# EAGLE design mapleCUL_small-V2.0_019 (EAGLE 9.1.1)
MAPLE-CUx Large Version
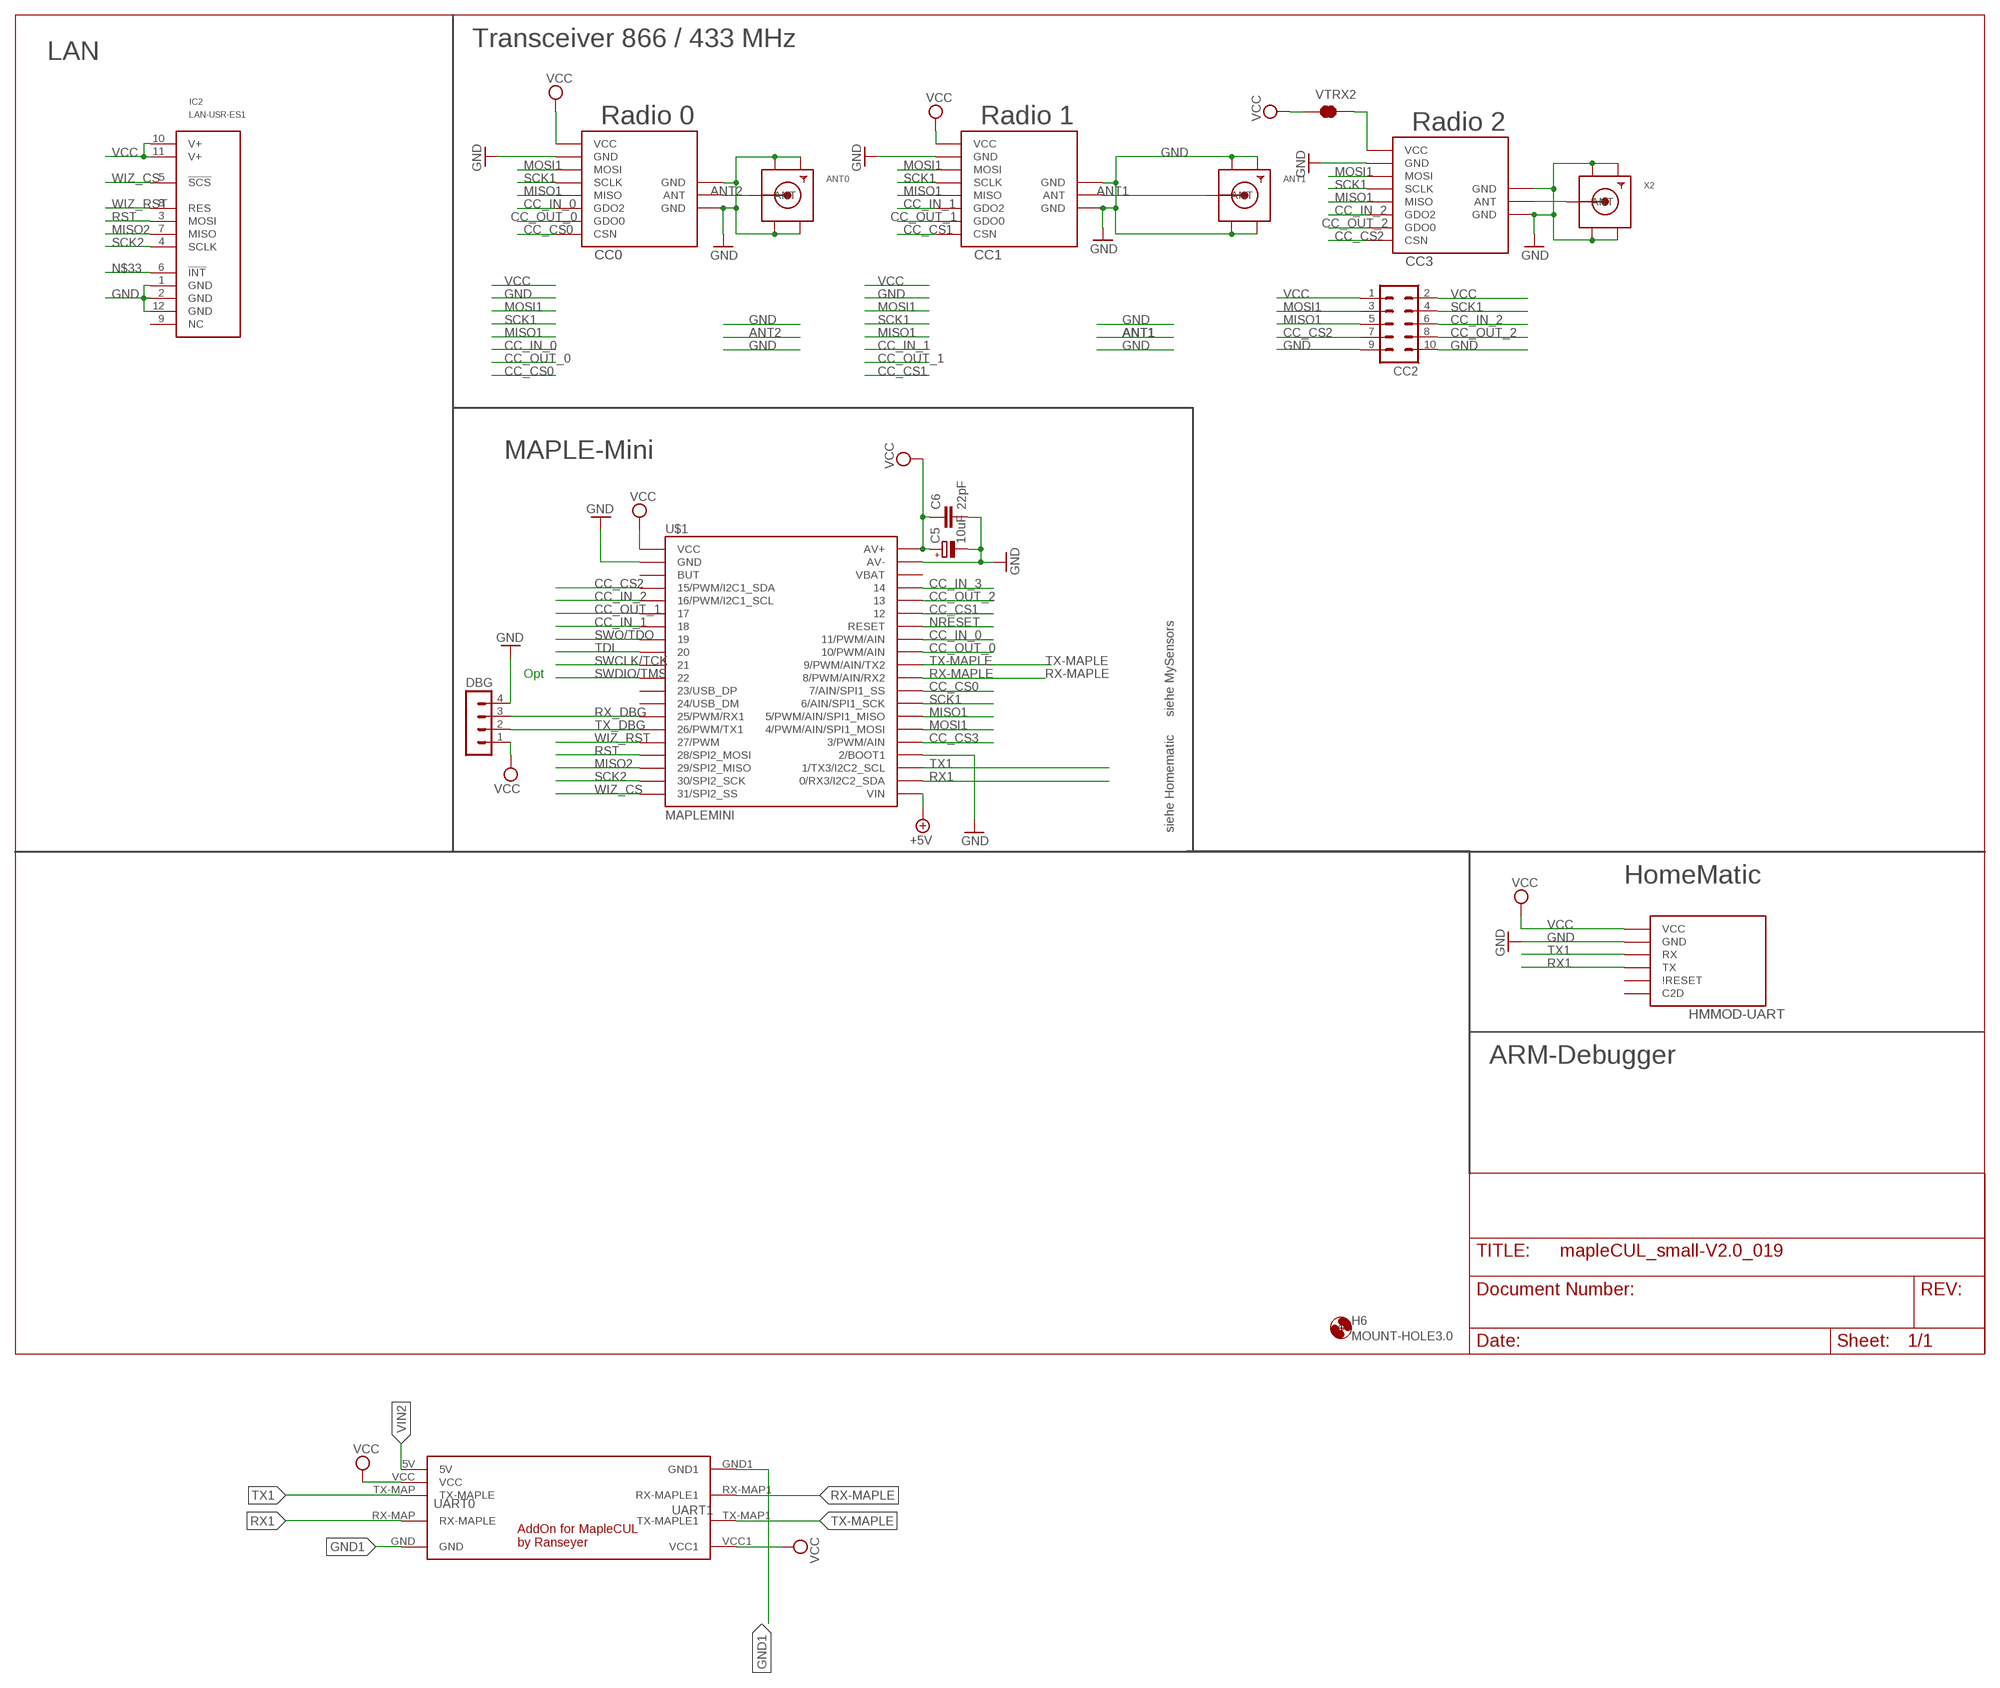
[diagram p0: schematic, sheet 1]

## Parts
ANT0  SMACONNECTOR_EDGE_UFL  [SMA_EDGELAUNCH_UFL]
ANT1  SMACONNECTOR_EDGE_UFL  [SMA_EDGELAUNCH_UFL]
C5  10uF  CPOL-EUR/2012-12W  [R/2012-12W]
C6  22pF  C-EUC0805  [C0805]
CC0  CC1101  CC1101_MODULE1SMD  [CC1101_MODULE1_SMD]
CC1  CC1101_MODULE1SMD  [CC1101_MODULE1_SMD]
CC2  MA05-2  [MA05-2]
CC3  CC1101_MODULE1SMD  [CC1101_MODULE1_SMD]
DBG  MA04-1  [MA04-1]
H6  MOUNT-HOLE3.0  [3,0]
HMMOD-UART  HM-MOD-UARTDIL  [HM-MOD-UART-DIL]
IC2  LAN-USR-ES1  [USR-ES1]
U$1  MAPLEMINI  [20-DIP]
U$3  MAPLE-CUL-ADDON-V01  [MAPLE-CUL-V01]
VTRX2  JUMPER-SMT_2_NC_TRACE_SILK  [SMT-JUMPER_2_NC_TRACE_SILK]
X2  SMACONNECTOR_EDGE  [SMA_EDGELAUNCH]

## Nets
+5V [PWR]: U$1.21(VIN)
ANT1 [PWR]: ANT1.P(ANT) CC1.ANT
ANT2: ANT0.P(ANT) CC0.ANT
ANT3: CC3.ANT X2.P(ANT)
CC_CS0: CC0.CSN U$1.29(7/AIN/SPI1_SS)
CC_CS1: CC1.CSN U$1.35
CC_CS2: CC2.7 CC3.CSN U$1.4(15/PWM/I2C1_SDA)
CC_CS3: U$1.25(3/PWM/AIN)
CC_IN_0: CC0.GDO2 U$1.33(11/PWM/AIN)
CC_IN_1: CC1.GDO2 U$1.7
CC_IN_2: CC2.6 CC3.GDO2 U$1.5(16/PWM/I2C1_SCL)
CC_IN_3: U$1.37
CC_OUT_0: CC0.GDO0 U$1.32(10/PWM/AIN)
CC_OUT_1: CC1.GDO0 U$1.6
CC_OUT_2: CC2.8 CC3.GDO0 U$1.36
GND [PWR]: ANT0.GND@1(GND1) ANT0.GND@2(GND2) ANT0.GND@3(GND3) ANT0.GND@4(GND4) ANT1.GND@1(GND1) ANT1.GND@2(GND2) ANT1.GND@3(GND3) ANT1.GND@4(GND4) C5.- C6.2 CC0.GND@0(GND) CC0.GND@1(GND) CC0.GND@2(GND) CC1.GND@0(GND) CC1.GND@1(GND) CC1.GND@2(GND) CC2.9 CC2.10 CC3.GND@0(GND) CC3.GND@1(GND) CC3.GND@2(GND) DBG.4 HMMOD-UART.2(GND) IC2.1(GND) IC2.2(GND) IC2.12(GND) U$1.2(GND) U$1.24(2/BOOT1) U$1.39(AV-) X2.GND@1(GND4) X2.GND@2(GND3) X2.GND@3(GND2) X2.GND@4(GND1)
GND1 [PWR]: U$3.GND U$3.GND1
MISO1: CC0.MISO CC1.MISO CC2.5 CC3.MISO U$1.27(5/PWM/AIN/SPI1_MISO)
MISO2: IC2.7(MISO) U$1.18(29/SPI2_MISO)
MOSI1: CC0.MOSI CC1.MOSI CC2.3 CC3.MOSI U$1.26(4/PWM/AIN/SPI1_MOSI)
N$1 [PWR]: CC3.VCC VTRX2.2
N$33: IC2.6(!INT!)
NRESET: U$1.34(RESET)
RST: IC2.3(MOSI) U$1.17(28/SPI2_MOSI)
RX1: HMMOD-UART.5(TX) U$1.22(0/RX3/I2C2_SDA) U$3.RX-MAP(RX-MAPLE)
RX-MAPLE: U$1.30(8/PWM/AIN/RX2) U$3.RX-MAP1(RX-MAPLE1)
RX_DBG: DBG.3 U$1.14(25/PWM/RX1)
SCK1: CC0.SCLK CC1.SCLK CC2.4 CC3.SCLK U$1.28(6/AIN/SPI1_SCK)
SCK2: IC2.4(SCLK) U$1.19(30/SPI2_SCK)
SWCLK/TCK: U$1.10
SWDIO/TMS: U$1.11
SWO/TDO: U$1.8
TDI: U$1.9
TX1: HMMOD-UART.6(RX) U$1.23(1/TX3/I2C2_SCL) U$3.TX-MAP(TX-MAPLE)
TX-MAPLE: U$1.31(9/PWM/AIN/TX2) U$3.TX-MAP1(TX-MAPLE1)
TX_DBG: DBG.2 U$1.15(26/PWM/TX1)
VCC [PWR]: C5.+ C6.1 CC0.VCC CC1.VCC CC2.1 CC2.2 DBG.1 HMMOD-UART.1(VCC) IC2.10(V+) IC2.11(V+) U$1.1(VCC) U$1.40(AV+) U$3.VCC U$3.VCC1 VTRX2.1
VIN2 [PWR]: U$3.5V
WIZ_CS: IC2.5(!SCS!) U$1.20(31/SPI2_SS)
WIZ_RST: IC2.8(RES) U$1.16(27/PWM)
Unconnected: HMMOD-UART.3(C2D) HMMOD-UART.4(\!RESET) IC2.9(NC) U$1.3(BUT) U$1.12(23/USB_DP) U$1.13(24/USB_DM) U$1.38(VBAT)

## Notes on the sheet
- Transceiver 866 / 433 MHz
- LAN
- Radio 0 | Radio 1 | Radio 2
- MAPLE-Mini
- Opt
- siehe MySensors
- siehe Homematic
- HomeMatic
- ARM-Debugger
- UART0
- UART1

## Library data of the parts
ANT0 ANT1 X2 = adafruit:SMACONNECTOR: SMA Connector 90° DIP SMA Connector, 50 Ohm (4UConnector: 07259)
C5 = rcl:CPOL-EU: POLARIZED CAPACITOR, European symbol
C6 = rcl:C-EU: CAPACITOR, European symbol
CC0 CC1 CC3 = wireless:CC1101_MODULE1: CC1101 wireless module for 433/868 MHz (sold from Aliexpress). DIL version for mounting with pin header (and SMD soldering) and SMD only variant available.
CC2 = con-lstb:MA05-2: PIN HEADER; OC_FARNELL: unknown; OC_NEWARK: unknown
DBG = con-lstb:MA04-1: PIN HEADER; OC_FARNELL: unknown; OC_NEWARK: unknown
H6 = holes:MOUNT-HOLE: MOUNTING HOLE with drill center marker
HMMOD-UART = wireless:HM-MOD-UART: eQ3 HM-MOD-UART-AW-SH2 wireless module for 868 MHz. DIL version for mounting with pin header (antenna upwards) and SMD variant available (antenna downwards).
IC2 = Martin-Communication:LAN-USR-ES1
U$1 = maplemini-small:MAPLEMINI
U$3 = Martin-Communication-V4:MAPLE-CUL-ADDON-V01: AddOn for MAPLE-CUL V4.x
VTRX2 = SparkFun-Jumpers:JUMPER-SMT_2_NC_TRACE: Normally closed trace jumper This jumper has a trace between two pads so it's normally closed (NC). Use a razor knife to open the connection. For best results follow the IPC guidelines for cutting traces: Cutout at least 0.063 mm (0.005 in). Remove all loose material to clean up the cut area. Seal the cut with an approved epoxy. Reapply solder to reclose the connection.

## Net classes
0 default: width 0.305 mm
1 PWR: width 0.406 mm

## Board
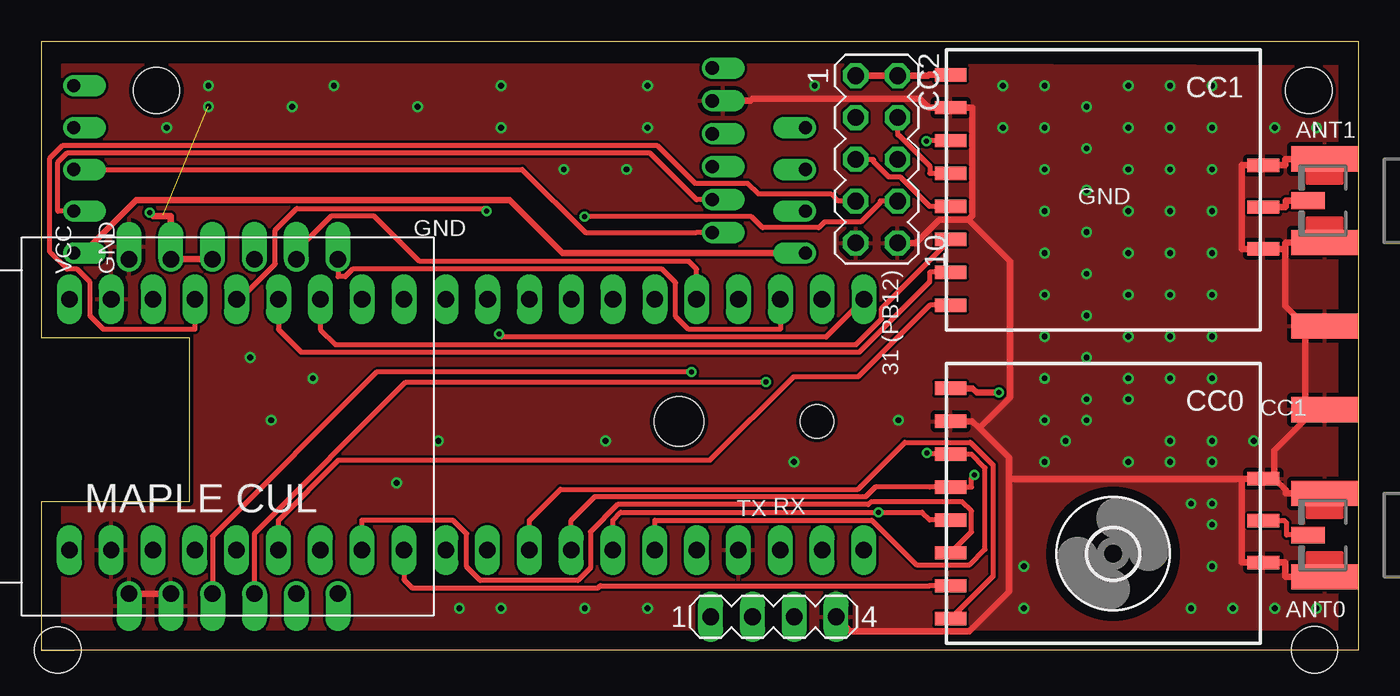
[diagram p1: board, top side]
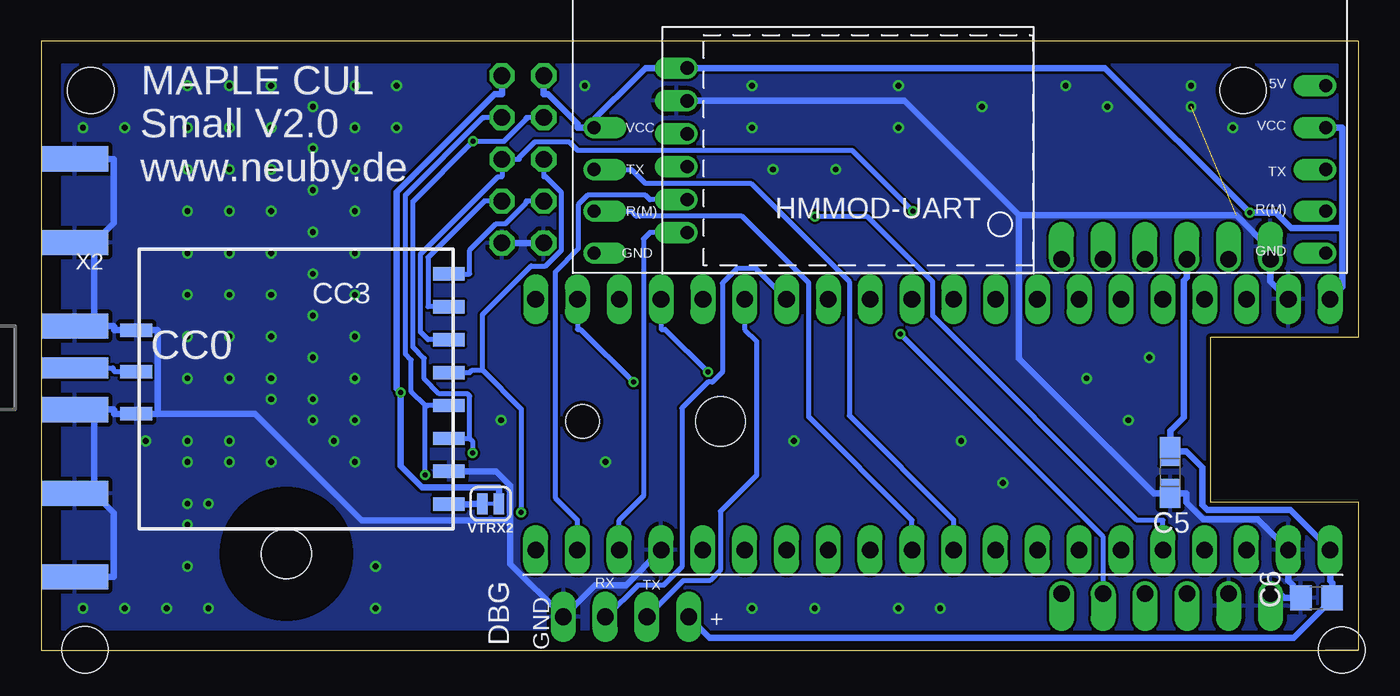
[diagram p2: board, bottom side, seen from below]

Size 80 x 37 mm. Coordinates in mm from the lower left corner, seen from the top.
Outline: 2,0 80,0 80,37 0,37 0,19 9,19 9,9 0,9 0,0
Outline: 2,0 1,0 0,0
Outline: 0,0 2,0
Copper layers (1*16): Top 0.035mm / dielectric 1.5mm / Bottom 0.035mm
Design rules "Fusion_eagle_rule_v1.1": minimum track width 6mil, minimum drill 12mil, track to track 6mil, track to pad 6mil, pad to pad 6mil, via to via 6mil, smd to smd 0mil, copper to edge 10mil, drill to drill 10mil, minimum pad ring 10mil, minimum via ring 6mil, stop-mask expansion 2mil, vias tented up to drill 100mil, thermal gap 10mil
Holes 2.8 mm at 1,0 77,34 77.35,0.01 7,34
Holes 2 mm at 47.13,13.89
Holes 3 mm at 38.74,13.89
tRestrict: 1 lines
bRestrict: 1 lines

### Footprints (pad centres in the part's own frame; a part is rotated, then mirrored left to right if it is on the bottom)
SMA_EDGELAUNCH_UFL = smd 4.064 x 1.524: GND@1 2.032,-2.54; GND@2 2.032,2.54 | smd 4.064 x 1.524 bottom: GND@3 2.032,2.54; GND@4 2.032,-2.54 | smd 2.032 x 1.016: P 3.048,0
R/2012-12W = smd 1.75 x 1.26: + 1.275,0; - -1.275,0
C0805 = smd 1.3 x 1.5: 1 -0.95,0; 2 0.95,0
CC1101_MODULE1_SMD = smd 1.93 x 0.813: ANT 19,5.96; CSN 0,0; GDO0 0,2; GDO2 0,4; GND@0 0,12; GND@1 19,8.5; GND@2 19,3.42; MISO 0,6; MOSI 0,10; SCLK 0,8; VCC 0,14
MA05-2 = drill 1.016 octagon: 1 -5.08,-1.27; 2 -5.08,1.27; 3 -2.54,-1.27; 4 -2.54,1.27; 5 0,-1.27; 6 0,1.27; 7 2.54,-1.27; 8 2.54,1.27; 9 5.08,-1.27; 10 5.08,1.27
MA04-1 = drill 1.016 long: 1 -3.81,0; 2 -1.27,0; 3 1.27,0; 4 3.81,0
3,0 = hole 3: 0,0
HM-MOD-UART-DIL = drill 0.8 offset: 1 0,12; 2 0,10; 3 0,8; 4 0,6; 5 0,4; 6 0,2
USR-ES1 = drill 1 pad 1.35 offset: 1 -10.16,5.715; 2 -10.16,3.175; 3 -10.16,0.635; 4 -10.16,-1.905; 5 -10.16,-4.445; 6 -10.16,-6.985; 7 10.16,-6.985; 8 10.16,-4.445; 9 10.16,-1.905; 10 10.16,0.635; 11 10.16,3.175; 12 10.16,5.715
20-DIP = drill 1.016 pad 1.27 long: 1 -24.13,-7.62; 2 -21.59,-7.62; 3 -19.05,-7.62; 4 -16.51,-7.62; 5 -13.97,-7.62; 6 -11.43,-7.62; 7 -8.89,-7.62; 8 -6.35,-7.62; 9 -3.81,-7.62; 10 -1.27,-7.62; 11 1.27,-7.62; 12 3.81,-7.62; 13 6.35,-7.62; 14 8.89,-7.62; 15 11.43,-7.62; 16 13.97,-7.62; 17 16.51,-7.62; 18 19.05,-7.62; 19 21.59,-7.62; 20 24.13,-7.62 | drill 1 pad 1.27 long: 21 24.13,7.62; 22 21.59,7.62; 23 19.05,7.62; 24 16.51,7.62; 25 13.97,7.62; 26 11.43,7.62; 27 8.89,7.62; 28 6.35,7.62; 29 3.81,7.62; 30 1.27,7.62; 31 -1.27,7.62; 32 -3.81,7.62; 33 -6.35,7.62; 34 -8.89,7.62; 35 -11.43,7.62; 36 -13.97,7.62; 37 -16.51,7.62; 38 -19.05,7.62; 39 -21.59,7.62; 40 -24.13,7.62
MAPLE-CUL-V01 = drill 0.8 offset: 5V 1.27,2.54; GND 1.27,12.7; GND1 45.72,12.7; RX-MAP 1.27,10.16; RX-MAP1 45.72,10.16; TX-MAP 1.27,7.62; TX-MAP1 45.72,7.62; VCC 1.27,5.08; VCC1 45.72,5.08
SMT-JUMPER_2_NC_TRACE_SILK = smd 0.635 x 1.27: 1 -0.508,0; 2 0.508,0
SMA_EDGELAUNCH = smd 4.064 x 1.524: GND@1 2.032,-2.54; GND@2 2.032,2.54 | smd 4.064 x 1.524 bottom: GND@3 2.032,2.54; GND@4 2.032,-2.54 | smd 4.064 x 1.27: P 2.032,0

### Placement (x,y rotation side)
ANT0  80.01,6.99 180 top
ANT1  80.01,27.3 180 top
C5  11.43,10.79 90 bottom
C6  2.54,3.17 180 bottom
CC0  55.24,1.91 0 top
CC1  55.24,20.95 0 top
CC2  50.75,29.82 270 top
CC3  55.24,22.86 180 bottom
DBG  44.48,2.02 0 top
H6  65.11,5.85 0 top
HMMOD-UART  40.77,23.37 0 bottom
IC2  11.05,13.59 90 top
U$1  25.84,13.7 180 bottom
U$3  0.7,36.83 180 bottom
VTRX2  52.7,8.89 180 bottom
X2  80.01,17.14 0 bottom

### Tracks (layer width: path | path; a pad name or v marks a point on that pad's centre or on a via)
ANT1
  Top 0.406: ANT1.P 75.59,27.3 75.59,26.94 75.57,26.91 CC1.ANT
ANT2
  Top 0.305: ANT0.P 75.64,6.99 75.64,7.74 75.52,7.87 CC0.ANT
ANT3
  Bottom 0.305: X2.P 75.64,17.14 75.64,17.03 75.52,16.9 CC3.ANT
CC_CS0
  Top 0.305: U$1.29 29.65,7.89 31.54,9.77 49.6,9.77 52.46,12.63 56.44,12.63 57.81,11.25 57.81,4.47 CC0.CSN
CC_CS1
  Top 0.305: CC1.CSN 53.98,20.95 49.64,16.62 45.71,16.62 40.64,11.55 18.07,11.55 14.41,7.89 U$1.35
CC_CS2
  Top 0.305: CC2.7 48.41,27.28 47.97,27.72 43.56,27.72 42.91,28.37 39.7,28.37 37.4,30.67 1.31,30.67 0.53,29.89 0.53,24.19 1.57,23.15 2.18,23.15 2.98,22.35 2.98,20.3 3.79,19.49 9.34,19.49 U$1.4
  Bottom 0.305: CC2.7 50.55,27.28 50.55,27.17 51.81,25.91 52.37,25.91 53.98,24.3 53.98,22.86 CC3.CSN
CC_IN_0
  Top 0.305: CC0.GDO2 56.52,7.17 56.52,8.45 55.94,9.02 50.42,9.02 50.24,8.84 35.01,8.84 33.36,7.19 33.36,4.99 32.6,4.22 26.68,4.22 25.84,5.05 25.84,7.07 25.02,7.89 19.49,7.89 U$1.33
CC_IN_1
  Top 0.305: U$1.7 16.95,19.49 17.88,18.56 49.5,18.56 51.04,20.1 51.04,20.75 CC1.GDO2
CC_IN_2  (via drill 0.3 pad 0.61)
  Top 0.305: U$1.5 12.08,21.32 14.22,23.46 14.22,25.53 15.53,26.84 26.9,26.84 v27.06,26.68
  Bottom 0.305: v27.06,26.68 30.75,30.37 47.42,30.37 47.95,30.89 50.02,30.89 50.95,29.95 50.95,29.82 CC2.6 52.02,28.75 52.27,28.75 56.97,24.05 56.97,19.32 56.52,18.86 CC3.GDO2
CC_OUT_0
  Top 0.305: CC0.GDO0 53.98,3.9 33.96,3.9 33.82,3.77 22.54,3.77 22.04,4.27 U$1.32
CC_OUT_1
  Top 0.305: CC1.GDO0 53.98,22.95 53.98,22.39 49.69,18.11 15.8,18.11 14.41,19.49 U$1.6
CC_OUT_2  (via drill 0.3 pad 0.61)
  Top 0.305: v33,26.34 43.15,26.34 43.82,25.66 47.24,25.66 47.59,26.01 49.79,26.01 50.95,27.17 50.95,27.28 CC2.8
  Bottom 0.305: U$1.36 11.87,7.89 13.45,7.89 25.84,20.29 25.84,22.37 29.81,26.34 v33,26.34 | CC3.GDO0 56.52,20.86 56.52,23.85 53.09,27.28 CC2.8
GND  (via drill 0.35)  (1 unrouted)
  Top 0.406: 56.98,13.49 56.57,13.9 CC0.GND@0 | 58.77,10.4 58.77,11.7 56.98,13.49 | 56.32,26.15 58.84,23.64 58.84,15.35 56.98,13.49 | 56.32,26.15 54.55,26.15 53.14,24.74 CC2.10 | 56.32,26.15 56.57,26.4 56.57,32.95 CC1.GND@0 54.59,32.95 53.92,32.95 53.38,33.5 43.22,33.5 43.09,33.37 HMMOD-UART.2 | 58.77,10.4 72.92,10.4 | DBG.4 49.17,1.14 56.38,1.14 58.77,3.53 58.77,10.4 | 75.57,24.38 75.57,24.74 75.59,24.77 ANT1.GND@3 | 75.57,24.38 CC1.GND@2 72.92,24.38 72.92,29.45 CC1.GND@1 75.57,29.45 75.57,29.82 75.59,29.84 ANT1.GND@1 | 76.78,19.68 75.57,20.9 75.57,24.38 | 76.78,19.68 77.38,19.68 X2.GND@3 | 77.38,14.61 74.91,12.13 74.91,10.4 | 77.38,14.61 76.78,14.61 76.78,19.68 | X2.GND@4 77.38,14.61 | 72.92,10.4 CC0.GND@1 74.91,10.4 | 72.92,10.4 72.92,5.33 CC0.GND@2 74.83,5.33 75.57,5.33 75.57,4.47 75.59,4.45 ANT0.GND@2 | 74.91,10.4 75.59,9.72 75.59,9.53 ANT0.GND@1 | IC2.2 IC2.1
  Bottom 0.406: 51.52,7.89 60.53,7.89 67,14.36 72.92,14.36 | 51.52,7.89 51.52,5.25 DBG.4 46.37,3.94 44.5,3.94 U$1.24 | 51.52,7.89 51.52,10 52.38,10.86 53.92,10.86 CC3.GND@0 | 20.63,26.43 20.63,17.73 12.42,9.52 C5.- 10.44,9.52 10.44,8.98 9.41,7.94 6.12,7.94 U$1.39 4.25,4.22 3.99,3.96 3.99,3.17 | HMMOD-UART.2 27.57,33.37 20.63,26.43 | 20.63,26.43 7.43,26.43 5.33,24.34 IC2.12 5.33,22.4 U$1.2 | CC2.10 CC2.9 | 76.78,19.68 75.59,19.68 75.57,19.66 75.57,19.44 CC3.GND@2 72.92,19.44 72.92,14.36 | X2.GND@3 76.78,19.68 | 76.78,19.68 76.78,24.77 | 72.92,14.36 CC3.GND@1 75.57,14.36 75.57,14.58 75.59,14.61 76.78,14.61 | ANT1.GND@1 75.59,29.84 75.59,25.96 76.78,24.77 | ANT1.GND@3 76.78,24.77 | X2.GND@4 76.78,14.61 | 76.78,14.61 76.78,9.53 | 3.99,3.17 4.5,3.17 4.75,3.43 IC2.1 | C6.2 3.99,3.17 | ANT0.GND@2 75.59,4.45 75.59,8.33 76.78,9.53 | ANT0.GND@1 76.78,9.53
  other vias: 10.16,33.02 10.16,34.29 7.62,31.75 17.78,34.29 27.94,34.29 36.83,34.29 36.83,31.75 27.94,31.75 35.56,29.21 31.75,29.21 12.7,17.78 16.51,16.51 13.97,13.97 24.13,12.7 21.59,10.16 34.29,12.7 46.99,34.29 45.72,11.43 52.07,13.97 25.4,2.54 27.94,2.54 36.83,2.54 33.02,2.54 77.47,2.54 72.39,2.54 59.69,2.54 71.12,5.08 71.12,7.62 71.12,11.43 71.12,12.7 60.96,11.43 60.96,13.97 60.96,16.51 71.12,16.51 60.96,19.05 60.96,21.59 60.96,24.13 71.12,24.13 71.12,21.59 71.12,19.05 66.04,11.43 66.04,16.51 66.04,19.05 66.04,21.59 66.04,24.13 66.04,15.24 60.96,26.67 60.96,29.21 60.96,31.75 60.96,34.29 66.04,26.67 66.04,29.21 66.04,31.75 66.04,34.29 71.12,26.67 71.12,29.21 71.12,31.75 71.12,34.29 74.93,31.75 77.47,31.75 58.42,31.75 58.42,34.29 63.5,33.02 63.5,30.48 63.5,27.94 63.5,25.4 63.5,22.86 63.5,20.32 63.5,17.78 63.5,15.24 63.5,13.97 69.85,2.54 59.69,5.08 22.86,33.02 15.24,33.02 68.58,11.43 68.58,12.7 68.58,16.51 68.58,19.05 68.58,21.59 68.58,24.13 68.58,26.67 68.58,29.21 68.58,31.75 68.58,34.29 71.12,8.89 69.85,8.89 62.23,12.7 73.66,12.7 74.93,2.54
  pour Top: 1.27,1.27 78.74,1.27 78.74,35.56 1.27,35.56
  pour Bottom: 1.27,35.56 78.74,35.56 78.74,1.27 1.27,1.27
GND1
  Top 0.406: U$3.GND1 31.69,24.12 28.47,27.34 5.78,27.34 2.56,24.12 U$3.GND
MISO1  (via drill 0.3 pad 0.61)
  Top 0.305: CC0.MISO 53.98,7.91 53.51,8.37 v50.85,8.37 35.21,8.37 34.73,7.89 U$1.27 | CC1.MISO 53.98,26.95 52.18,28.75 51.48,28.75 50.55,29.69 50.55,29.82 CC2.5
  Bottom 0.305: 53.21,17.01 50.85,14.65 v50.85,8.37 | 53.21,17.01 53.21,20.37 50.24,23.34 49.36,23.34 48.41,24.29 48.41,27.8 49.37,28.75 49.48,28.75 CC2.5 | 53.21,17.01 53.83,17.01 53.98,16.86 CC3.MISO
MISO2
  Top 0.305: U$1.18 44.9,19.49 39.32,19.49 38.54,20.27 38.54,22.32 37.72,23.15 18.93,23.15 18.47,22.69 18.03,22.69 IC2.7
MOSI1  (via drill 0.3 pad 0.61)
  Top 0.305: CC1.MOSI 53.98,30.95 53.93,30.91 v53.77,30.91 | U$1.26 37.27,7.89 50.45,7.89 53.16,5.18 56.41,5.18 57.34,6.11 57.34,11.08 56.52,11.9 CC0.MOSI 53.98,11.9 53.89,11.99 v53.82,11.99
  Bottom 0.305: 53.98,12.86 | 53.98,12.86 53.98,15.43 54.12,15.57 55.83,15.57 56.74,16.49 56.74,17.73 57.43,18.42 57.43,27.25 v53.77,30.91 51.89,30.91 50.55,32.25 50.55,32.36 CC2.3 | 53.98,12.86 53.82,12.7 v53.82,11.99 | 53.98,12.86 54.09,12.86 CC3.MOSI
N$1
  Bottom 0.406: CC3.VCC 53.92,8.86 53.89,8.89 VTRX2.2
RST  (via drill 0.3 pad 0.61)
  Top 0.305: v39.5,16.89 20.38,16.89 10.41,6.92 IC2.3
  Bottom 0.305: U$1.17 42.35,19.49 42.1,19.49 v39.5,16.89
RX1
  Top 0.305: HMMOD-UART.5 39.81,27.37 36.96,30.21 1.59,30.21 1.02,29.64 1.02,26.66 U$3.RX-MAP
  Bottom 0.305: U$1.22 47.43,7.89 48.79,9.25 48.79,22.98 47.38,24.39 47.38,27.07 46.81,27.64 43.31,27.64 43.03,27.37 HMMOD-UART.5
RX-MAPLE
  Bottom 0.305: U$1.30 27.11,7.89 33.38,14.16 33.38,22.3 37.45,26.37 43.86,26.37 44.16,26.66 U$3.RX-MAP1
RX_DBG
  Bottom 0.305: U$1.14 36.59,23.17 37.76,23.17 38.64,22.29 38.64,16.89 39.24,16.28 39.51,16.28 41.08,14.7 41.08,5.05 42.19,3.94 43.77,3.94 45.69,2.02 DBG.3
SCK1  (via drill 0.3 pad 0.61)
  Top 0.305: U$1.28 32.19,7.89 33.62,9.32 50.08,9.32 50.66,9.9 53.98,9.9 CC0.SCLK 56.52,9.9 56.52,10.47 v56.69,10.64 | CC1.SCLK 53.98,28.95 53.98,29.42 52.1,31.29 52.02,31.29 CC2.4
  Bottom 0.305: 56.69,14.86 57.53,15.7 57.53,17.64 57.89,18 57.89,27.66 53.18,32.36 53.09,32.36 CC2.4 | 56.69,14.86 56.52,14.86 CC3.SCLK | v56.69,10.64 56.69,14.86
SCK2  (via drill 0.3 pad 0.61)
  Top 0.305: IC2.4 12.95,7.08 22.15,16.28 v44.04,16.28
  Bottom 0.305: v44.04,16.28 47.25,19.49 47.43,19.49 U$1.19
TX1
  Top 0.305: U$3.TX-MAP 29.23,29.2 33.06,25.37 39.81,25.37 HMMOD-UART.6
  Bottom 0.305: U$1.23 44.9,7.89 43.43,9.36 43.43,24.98 43.03,25.37 HMMOD-UART.6
TX-MAPLE
  Bottom 0.305: U$1.31 24.57,7.89 30.92,14.24 30.92,22.38 36.91,28.37 43.32,28.37 44.16,29.2 U$3.TX-MAP1
TX_DBG
  Bottom 0.305: U$1.15 37.27,19.49 36.56,18.77 36.56,10.62 38.75,8.43 38.75,4.86 39.4,4.22 41.01,4.22 DBG.2
VCC  (via drill 0.3 pad 0.61)
  Top 0.406: CC2.1 CC2.2 53.87,34.9 53.92,34.95 CC1.VCC | v6.59,26.58 6.8,26.37 7.87,26.37 IC2.11 IC2.10 | v58.18,15.64 56.83,15.64 56.57,15.9 CC0.VCC
  Bottom 0.406: DBG.1 39.41,0.76 3.92,0.76 1.59,3.09 C6.1 1.59,4.09 1.71,4.22 U$1.40 4.14,8.5 9.16,8.5 9.48,8.82 9.48,11.1 10.44,12.07 C5.+ 11.43,13.3 10.6,14.13 10.6,22.45 10.41,22.64 IC2.10 | 0.96,25.64 4.07,25.64 5.01,26.58 v6.59,26.58 15.38,35.37 HMMOD-UART.1 43.31,35.37 46.93,31.75 | 46.93,31.75 47.44,31.75 47.44,32 49.22,33.78 49.48,33.78 CC2.1 | U$3.VCC1 46.93,31.75 | CC2.2 52.02,33.78 52.48,33.78 58.43,27.83 58.43,15.89 v58.18,15.64 58.18,11.2 56.86,9.88 52.2,9.88 VTRX2.1 | 0.96,25.64 0.96,22.07 U$1.1 | 0.96,25.64 0.96,31.75 U$3.VCC
WIZ_CS  (via drill 0.3 pad 0.61)
  Top 0.305: U$1.20 47.68,19.02 28,19.02 v27.82,19.2
  Bottom 0.305: IC2.5 15.49,6.87 v27.82,19.2
WIZ_RST
  Top 0.305: IC2.8 15.49,24.25 17.6,26.36 20.24,26.36 22.99,23.61 39.36,23.61 39.81,23.15 U$1.16

### Text on the board
tNames: GND | GND | VCC | GND | 31 (PB12) | CC1 | MAPLE CUL | TX | RX
bNames: MAPLE CUL | Small V2.0 / www.neuby.de | CC0 | TX | RX | GND | +